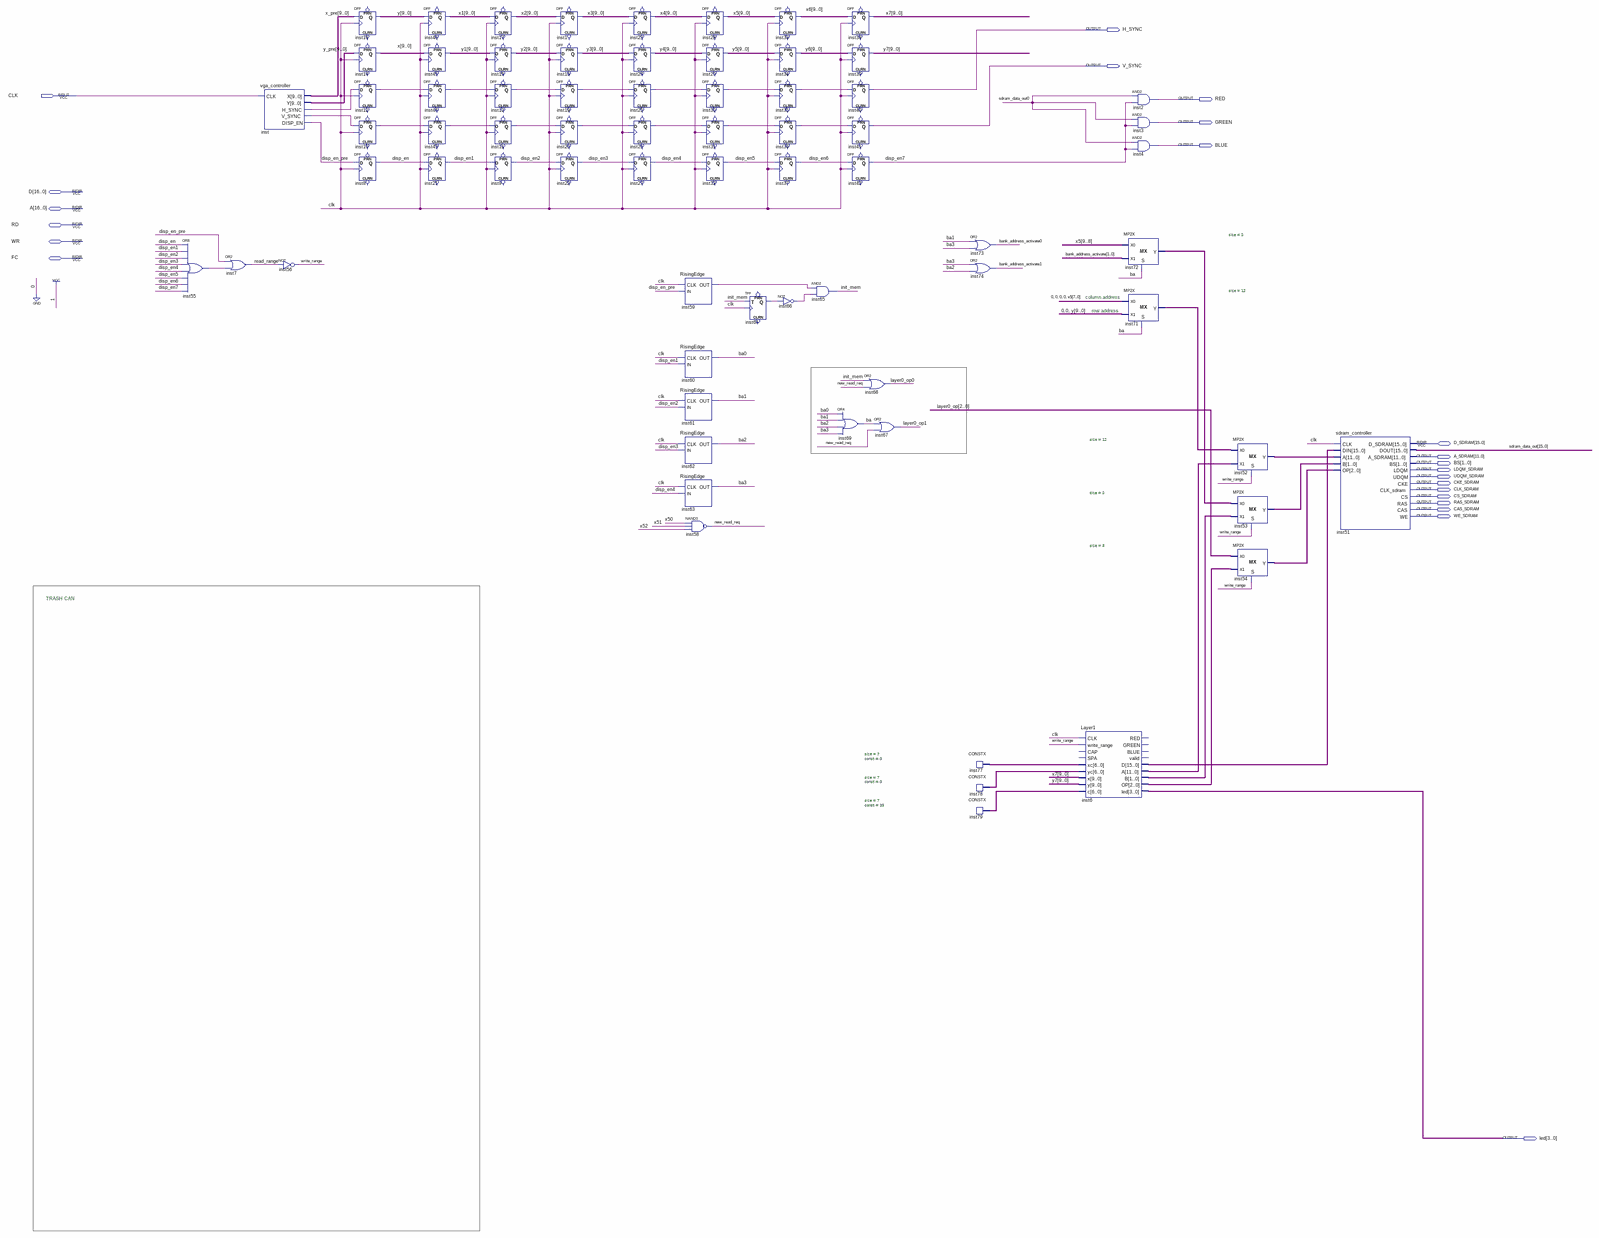
[diagram p0: schematic sheet, whole]
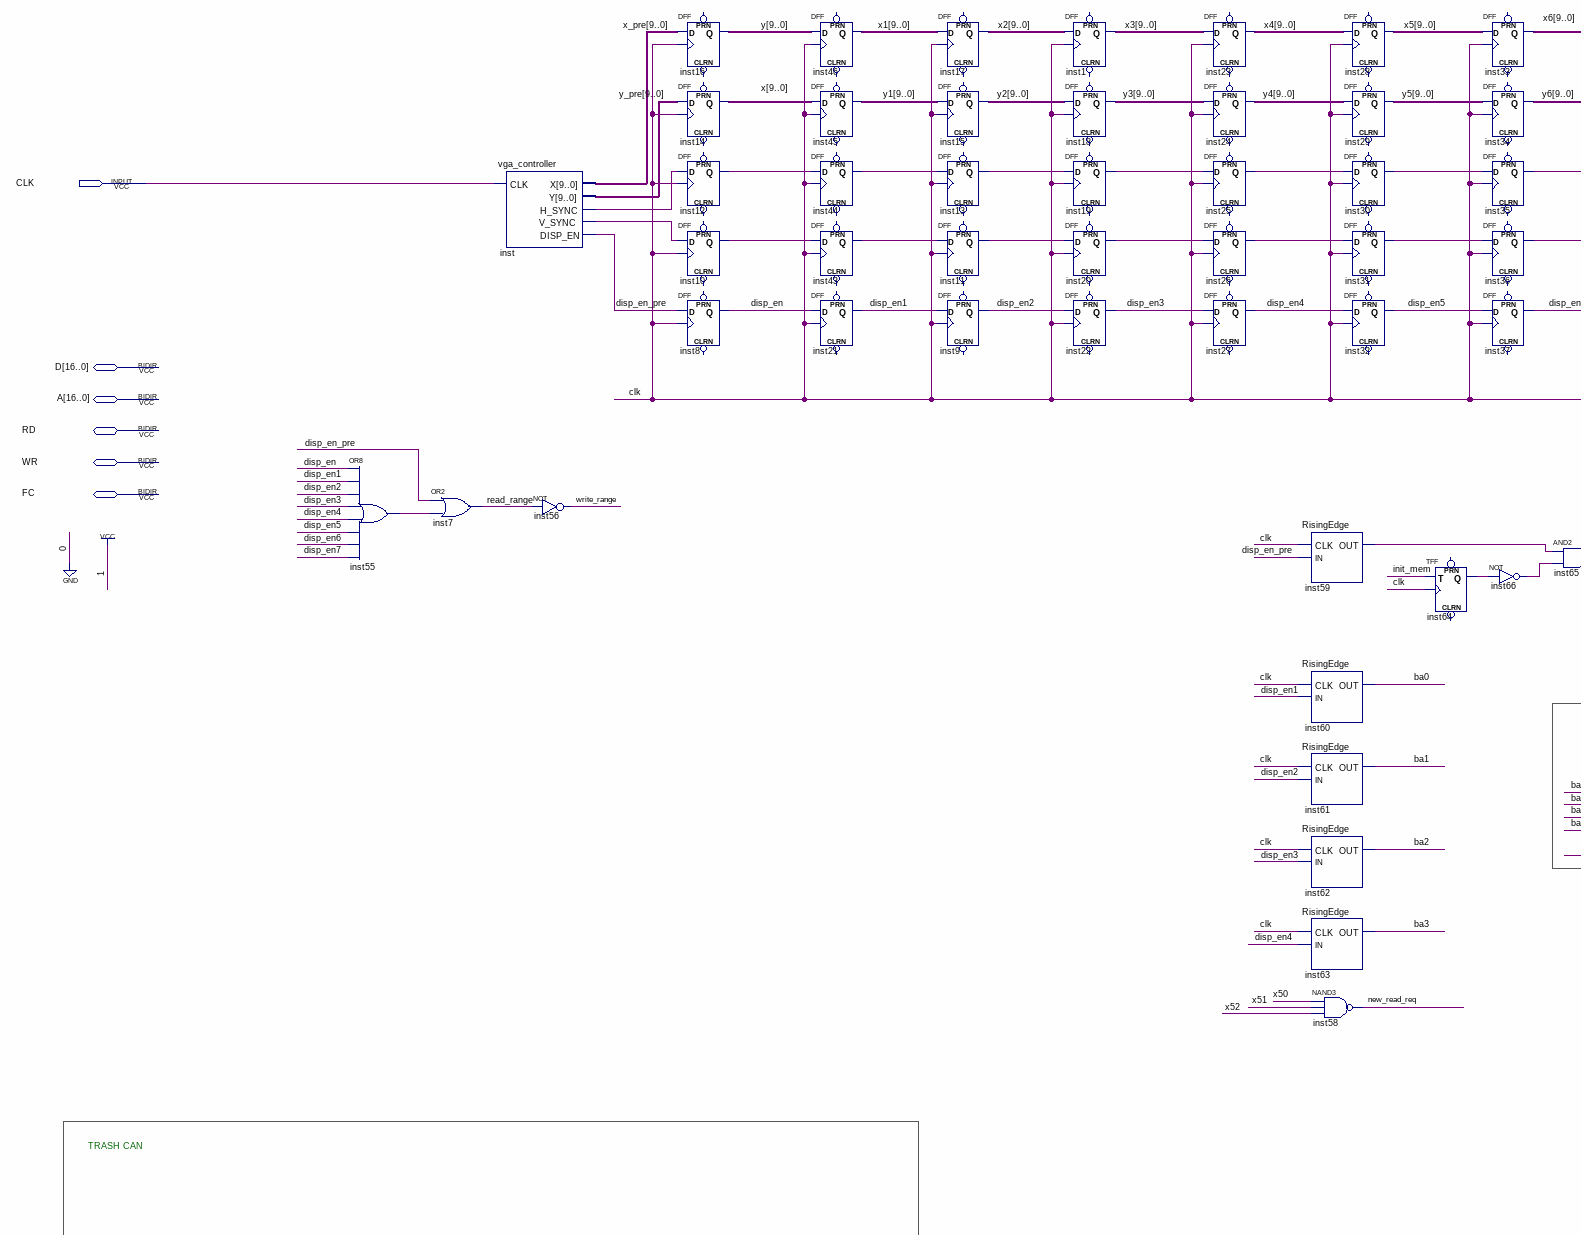
[diagram p1: schematic sheet, upper left part]
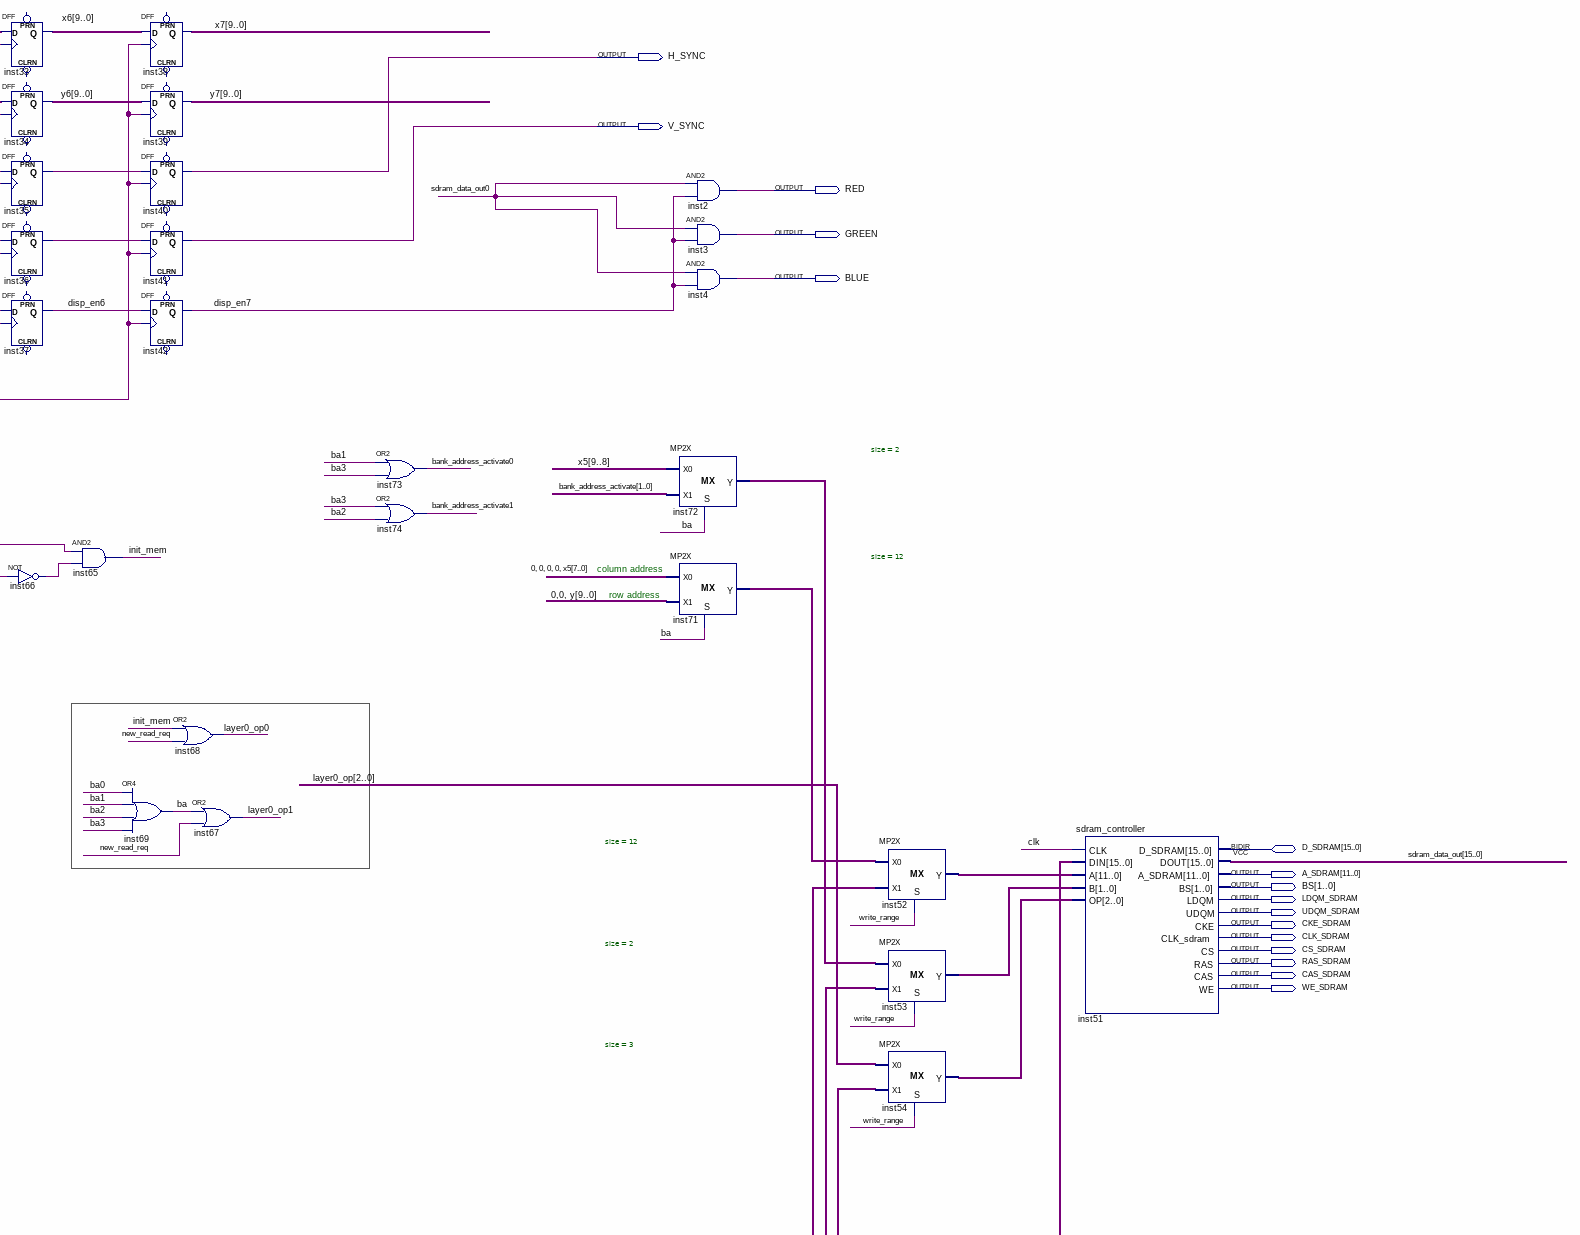
[diagram p2: schematic sheet, upper right part]
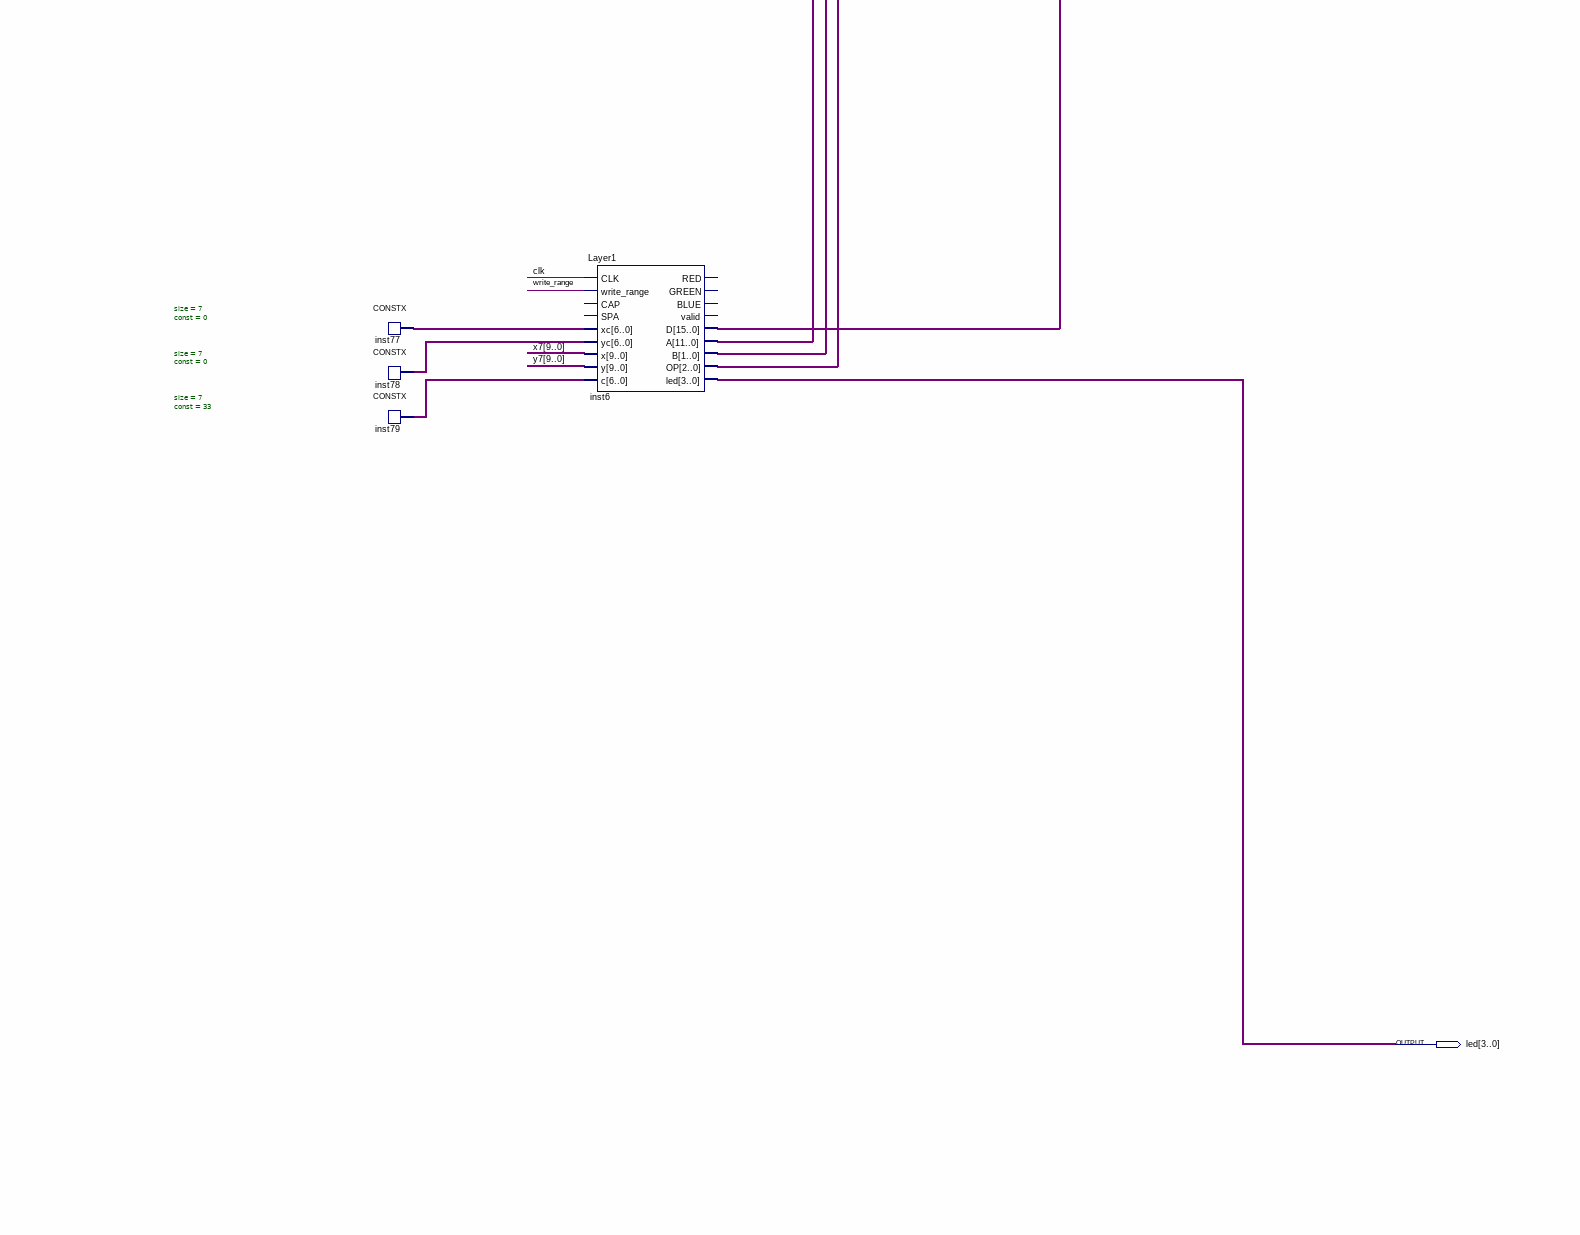
[diagram p3: schematic sheet, lower right part]
// Quartus schematic gpu.bdf as structural Verilog: 71 symbols, 23 pins
module gpu (
  input  CLK,
  inout  [16:0] D,
  inout  [16:0] A,
  inout  RD,
  inout  WR,
  inout  FC,
  inout  [15:0] D_SDRAM,
  output H_SYNC,
  output V_SYNC,
  output RED,
  output GREEN,
  output BLUE,
  output [11:0] A_SDRAM,
  output [1:0] BS,
  output LDQM_SDRAM,
  output UDQM_SDRAM,
  output CKE_SDRAM,
  output CLK_SDRAM,
  output CS_SDRAM,
  output RAS_SDRAM,
  output CAS_SDRAM,
  output WE_SDRAM,
  output [3:0] led
);

  wire ba, ba0, ba1, ba2, ba3, disp_en, disp_en1, disp_en2, disp_en3, disp_en4, disp_en5, disp_en6, disp_en7,
       disp_en_pre, init_mem, inst10_q, inst11_q, inst12_q, inst13_q, inst19_q, inst20_q, inst25_q, inst26_q,
       inst30_q, inst31_q, inst35_q, inst36_q, inst43_q, inst44_q, inst55_out, inst59_out, inst64_q,
       inst66_out, inst_h_sync, inst_v_sync, new_read_req, read_range, write_range;
  wire [1:0] bank_address_activate, inst6_b, inst53_y, inst72_y;
  wire [2:0] inst6_op, inst54_y, layer0_op;
  wire [6:0] inst77_data, inst78_data, inst79_data;
  wire [9:0] x, x1, x2, x3, x4, x5, x6, x7, x_pre, y, y1, y2, y3, y4, y5, y6, y7, y_pre;
  wire [11:0] inst6_a, inst52_y, inst71_y;
  wire [15:0] inst6_d, sdram_data_out;

  or inst55 (inst55_out, disp_en, disp_en1, disp_en2, disp_en3, disp_en4, disp_en5, disp_en6, disp_en7);
  or inst7 (read_range, disp_en_pre, inst55_out);
  vga_controller inst (
    .CLK(CLK), .X(x_pre), .Y(y_pre), .H_SYNC(inst_h_sync), .V_SYNC(inst_v_sync), .DISP_EN(disp_en_pre));
  not inst56 (write_range, read_range);
  DFF inst16[9:0] (.CLK(CLK), .D(x_pre), .Q(y));  // open: CLRN, PRN
  DFF inst14[9:0] (.CLK(CLK), .D(y_pre), .Q(x));  // open: CLRN, PRN
  DFF inst12 (.CLK(CLK), .D(inst_h_sync), .Q(inst12_q));  // open: CLRN, PRN
  DFF inst10 (.CLK(CLK), .D(inst_v_sync), .Q(inst10_q));  // open: CLRN, PRN
  DFF inst8 (.CLK(CLK), .D(disp_en_pre), .Q(disp_en));  // open: CLRN, PRN
  DFF inst46[9:0] (.CLK(CLK), .D(y), .Q(x1));  // open: CLRN, PRN
  DFF inst45[9:0] (.CLK(CLK), .D(x), .Q(y1));  // open: CLRN, PRN
  DFF inst44 (.CLK(CLK), .D(inst12_q), .Q(inst44_q));  // open: CLRN, PRN
  DFF inst43 (.CLK(CLK), .D(inst10_q), .Q(inst43_q));  // open: CLRN, PRN
  DFF inst21 (.CLK(CLK), .D(disp_en), .Q(disp_en1));  // open: CLRN, PRN
  DFF inst17[9:0] (.CLK(CLK), .D(x1), .Q(x2));  // open: CLRN, PRN
  DFF inst15[9:0] (.CLK(CLK), .D(y1), .Q(y2));  // open: CLRN, PRN
  DFF inst13 (.CLK(CLK), .D(inst44_q), .Q(inst13_q));  // open: CLRN, PRN
  DFF inst11 (.CLK(CLK), .D(inst43_q), .Q(inst11_q));  // open: CLRN, PRN
  DFF inst9 (.CLK(CLK), .D(disp_en1), .Q(disp_en2));  // open: CLRN, PRN
  DFF inst1[9:0] (.CLK(CLK), .D(x2), .Q(x3));  // open: CLRN, PRN
  DFF inst18[9:0] (.CLK(CLK), .D(y2), .Q(y3));  // open: CLRN, PRN
  DFF inst19 (.CLK(CLK), .D(inst13_q), .Q(inst19_q));  // open: CLRN, PRN
  DFF inst20 (.CLK(CLK), .D(inst11_q), .Q(inst20_q));  // open: CLRN, PRN
  DFF inst22 (.CLK(CLK), .D(disp_en2), .Q(disp_en3));  // open: CLRN, PRN
  DFF inst23[9:0] (.CLK(CLK), .D(x3), .Q(x4));  // open: CLRN, PRN
  DFF inst24[9:0] (.CLK(CLK), .D(y3), .Q(y4));  // open: CLRN, PRN
  DFF inst25 (.CLK(CLK), .D(inst19_q), .Q(inst25_q));  // open: CLRN, PRN
  DFF inst26 (.CLK(CLK), .D(inst20_q), .Q(inst26_q));  // open: CLRN, PRN
  DFF inst27 (.CLK(CLK), .D(disp_en3), .Q(disp_en4));  // open: CLRN, PRN
  RisingEdge inst59 (.CLK(CLK), .IN(disp_en_pre), .OUT(inst59_out));
  RisingEdge inst60 (.CLK(CLK), .IN(disp_en1), .OUT(ba0));
  RisingEdge inst61 (.CLK(CLK), .IN(disp_en2), .OUT(ba1));
  RisingEdge inst62 (.CLK(CLK), .IN(disp_en3), .OUT(ba2));
  RisingEdge inst63 (.CLK(CLK), .IN(disp_en4), .OUT(ba3));
  nand inst58 (new_read_req, x5[0], x5[1], x5[2]);
  DFF inst28[9:0] (.CLK(CLK), .D(x4), .Q(x5));  // open: CLRN, PRN
  DFF inst29[9:0] (.CLK(CLK), .D(y4), .Q(y5));  // open: CLRN, PRN
  DFF inst30 (.CLK(CLK), .D(inst25_q), .Q(inst30_q));  // open: CLRN, PRN
  DFF inst31 (.CLK(CLK), .D(inst26_q), .Q(inst31_q));  // open: CLRN, PRN
  DFF inst32 (.CLK(CLK), .D(disp_en4), .Q(disp_en5));  // open: CLRN, PRN
  TFF inst64 (.T(init_mem), .CLK(CLK), .Q(inst64_q));  // open: PRN, CLRN
  DFF inst33[9:0] (.CLK(CLK), .D(x5), .Q(x6));  // open: CLRN, PRN
  DFF inst34[9:0] (.CLK(CLK), .D(y5), .Q(y6));  // open: CLRN, PRN
  DFF inst35 (.CLK(CLK), .D(inst30_q), .Q(inst35_q));  // open: CLRN, PRN
  DFF inst36 (.CLK(CLK), .D(inst31_q), .Q(inst36_q));  // open: CLRN, PRN
  DFF inst37 (.CLK(CLK), .D(disp_en5), .Q(disp_en6));  // open: CLRN, PRN
  not inst66 (inst66_out, inst64_q);
  and inst65 (init_mem, inst59_out, inst66_out);
  or inst69 (ba, ba0, ba1, ba2, ba3);
  DFF inst38[9:0] (.CLK(CLK), .D(x6), .Q(x7));  // open: CLRN, PRN
  DFF inst39[9:0] (.CLK(CLK), .D(y6), .Q(y7));  // open: CLRN, PRN
  DFF inst40 (.CLK(CLK), .D(inst35_q), .Q(H_SYNC));  // open: CLRN, PRN
  DFF inst41 (.CLK(CLK), .D(inst36_q), .Q(V_SYNC));  // open: CLRN, PRN
  DFF inst42 (.CLK(CLK), .D(disp_en6), .Q(disp_en7));  // open: CLRN, PRN
  or inst68 (layer0_op[0], init_mem, new_read_req);
  or inst67 (layer0_op[1], ba, new_read_req);
  or inst73 (bank_address_activate[0], ba1, ba3);
  or inst74 (bank_address_activate[1], ba3, ba2);
  CONSTX #(.size(7), .\const (0)) inst77 (.data(inst77_data));
  CONSTX #(.size(7), .\const (0)) inst78 (.data(inst78_data));
  CONSTX #(.size(7), .\const (33)) inst79 (.data(inst79_data));
  Layer1 inst6 (
    .CLK(CLK), .write_range(write_range), .xc(inst77_data), .yc(inst78_data), .x(x7), .y(y7),
    .c(inst79_data), .D(inst6_d), .A(inst6_a), .B(inst6_b), .OP(inst6_op), .led(led));  // open: CAP, SPA, RED, GREEN, BLUE, valid
  and inst2 (RED, sdram_data_out[0], disp_en7);
  and inst3 (GREEN, sdram_data_out[0], disp_en7);
  and inst4 (BLUE, sdram_data_out[0], disp_en7);
  MP2X #(.size(2)) inst72 (.S(ba), .X0(x5[9:8]), .X1(bank_address_activate), .Y(inst72_y));
  MP2X #(.size(12)) inst71 (.S(ba), .X0({4'b0000, x5[7:0]}), .X1({2'b00, y}), .Y(inst71_y));
  MP2X #(.size(12)) inst52 (.S(write_range), .X0(inst71_y), .X1(inst6_a), .Y(inst52_y));
  MP2X #(.size(2)) inst53 (.S(write_range), .X0(inst72_y), .X1(inst6_b), .Y(inst53_y));
  MP2X #(.size(3)) inst54 (.S(write_range), .X0(layer0_op), .X1(inst6_op), .Y(inst54_y));
  sdram_controller inst51 (
    .CLK(CLK), .DIN(inst6_d), .A(inst52_y), .B(inst53_y), .OP(inst54_y), .DOUT(sdram_data_out),
    .A_SDRAM(A_SDRAM), .BS(BS), .LDQM(LDQM_SDRAM), .UDQM(UDQM_SDRAM), .CKE(CKE_SDRAM), .CLK_sdram(CLK_SDRAM),
    .CS(CS_SDRAM), .RAS(RAS_SDRAM), .CAS(CAS_SDRAM), .WE(WE_SDRAM), .D_SDRAM(D_SDRAM));

  // Notes on the sheet:
  //   column address
  //   row address
  //   TRASH CAN
endmodule
